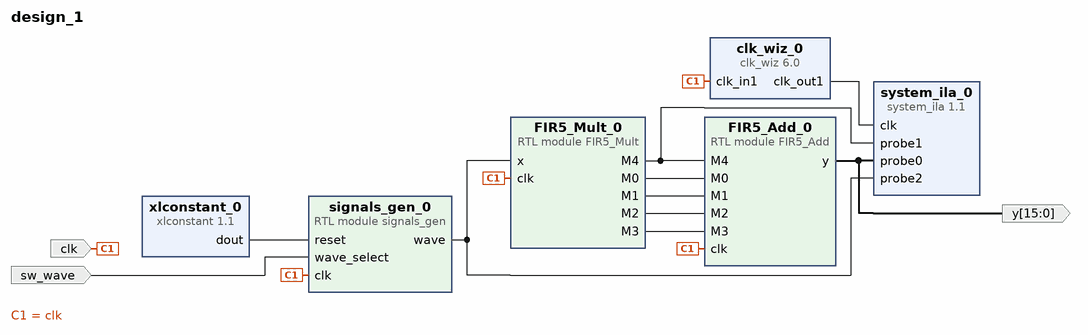
[diagram p0: block diagram of the top level]
# Vivado block design design_1, xc7z020clg400-1, Vivado 2020.2
create_bd_design design_1

create_bd_port -dir I -type clk clk
set_property -dict {CONFIG.FREQ_HZ 125000000} [get_bd_ports clk]
create_bd_port -dir I sw_wave
create_bd_port -dir O -from 15 -to 0 y

create_bd_cell -type module -reference FIR5_Mult FIR5_Mult_0
create_bd_cell -type module -reference signals_gen signals_gen_0
create_bd_cell -type module -reference FIR5_Add FIR5_Add_0
create_bd_cell -type ip -vlnv xilinx.com:ip:clk_wiz:6.0 clk_wiz_0
set_property -dict [list \
  CONFIG.CLKIN1_JITTER_PS 80.0 \
  CONFIG.CLKOUT1_DRIVES BUFG \
  CONFIG.CLKOUT1_JITTER 104.759 \
  CONFIG.CLKOUT1_PHASE_ERROR 96.948 \
  CONFIG.CLKOUT1_REQUESTED_OUT_FREQ 250 \
  CONFIG.CLKOUT2_DRIVES BUFG \
  CONFIG.CLKOUT3_DRIVES BUFG \
  CONFIG.CLKOUT4_DRIVES BUFG \
  CONFIG.CLKOUT5_DRIVES BUFG \
  CONFIG.CLKOUT6_DRIVES BUFG \
  CONFIG.CLKOUT7_DRIVES BUFG \
  CONFIG.ENABLE_CLOCK_MONITOR false \
  CONFIG.MMCM_BANDWIDTH OPTIMIZED \
  CONFIG.MMCM_CLKFBOUT_MULT_F 8 \
  CONFIG.MMCM_CLKIN1_PERIOD 8.000 \
  CONFIG.MMCM_CLKIN2_PERIOD 10.0 \
  CONFIG.MMCM_CLKOUT0_DIVIDE_F 4 \
  CONFIG.MMCM_COMPENSATION ZHOLD \
  CONFIG.MMCM_DIVCLK_DIVIDE 1 \
  CONFIG.PLL_CLKIN_PERIOD 8.000 \
  CONFIG.PRIMITIVE PLL \
  CONFIG.PRIM_IN_FREQ 125 \
  CONFIG.PRIM_SOURCE Global_buffer \
  CONFIG.USE_LOCKED false \
  CONFIG.USE_RESET false \
] [get_bd_cells clk_wiz_0]
create_bd_cell -type ip -vlnv xilinx.com:ip:system_ila:1.1 system_ila_0
set_property -dict [list \
  CONFIG.C_MON_TYPE NATIVE \
  CONFIG.C_NUM_OF_PROBES 3 \
  CONFIG.C_PROBE0_TYPE 1 \
  CONFIG.C_PROBE1_TYPE 0 \
  CONFIG.C_PROBE2_TYPE 0 \
] [get_bd_cells system_ila_0]
create_bd_cell -type ip -vlnv xilinx.com:ip:xlconstant:1.1 xlconstant_0

# ---- connections ----

connect_bd_net [get_bd_pins FIR5_Mult_0/M0] [get_bd_pins FIR5_Add_0/M0]
connect_bd_net [get_bd_pins FIR5_Mult_0/M1] [get_bd_pins FIR5_Add_0/M1]
connect_bd_net [get_bd_pins FIR5_Mult_0/M2] [get_bd_pins FIR5_Add_0/M2]
connect_bd_net [get_bd_pins FIR5_Mult_0/M3] [get_bd_pins FIR5_Add_0/M3]
connect_bd_net -net FIR5_Mult_0_M4 [get_bd_pins FIR5_Mult_0/M4] [get_bd_pins FIR5_Add_0/M4] [get_bd_pins system_ila_0/probe1]
connect_bd_net -net signals_gen_0_wave [get_bd_pins signals_gen_0/wave] [get_bd_pins FIR5_Mult_0/x] [get_bd_pins system_ila_0/probe2]
connect_bd_net -net wave_select_0_1 [get_bd_ports sw_wave] [get_bd_pins signals_gen_0/wave_select]
connect_bd_net -net FIR5_Add_0_y [get_bd_pins FIR5_Add_0/y] [get_bd_ports y] [get_bd_pins system_ila_0/probe0]
connect_bd_net -net clk_0_1 [get_bd_ports clk] \
  [get_bd_pins signals_gen_0/clk] [get_bd_pins FIR5_Mult_0/clk] [get_bd_pins FIR5_Add_0/clk] [get_bd_pins clk_wiz_0/clk_in1]
connect_bd_net [get_bd_pins clk_wiz_0/clk_out1] [get_bd_pins system_ila_0/clk]
connect_bd_net [get_bd_pins xlconstant_0/dout] [get_bd_pins signals_gen_0/reset]
set_property HDL_ATTRIBUTE.DEBUG true [get_bd_nets FIR5_Mult_0_M4]
set_property HDL_ATTRIBUTE.MARK_DEBUG true [get_bd_nets FIR5_Mult_0_M4]
set_property HDL_ATTRIBUTE.DEBUG true [get_bd_nets signals_gen_0_wave]
set_property HDL_ATTRIBUTE.MARK_DEBUG true [get_bd_nets signals_gen_0_wave]
set_property HDL_ATTRIBUTE.DEBUG true [get_bd_nets FIR5_Add_0_y]
set_property HDL_ATTRIBUTE.MARK_DEBUG true [get_bd_nets FIR5_Add_0_y]

validate_bd_design
save_bd_design
